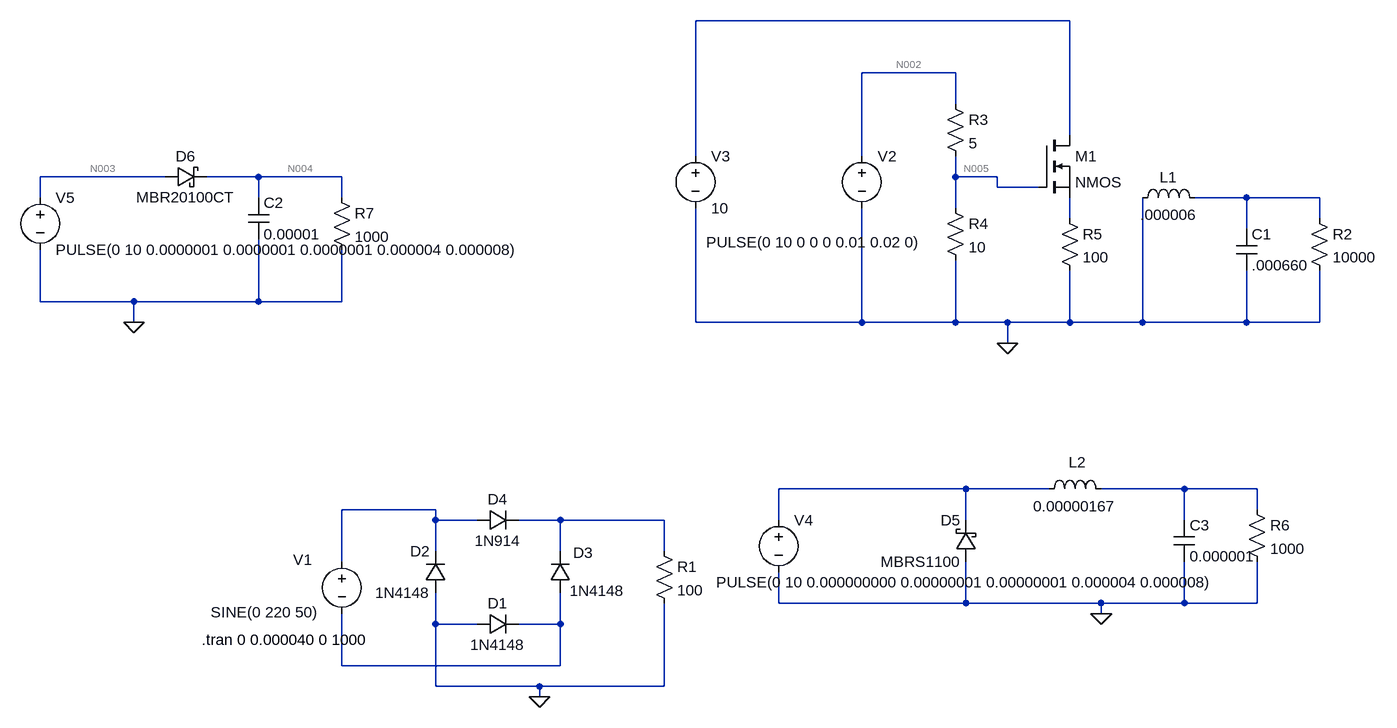
[diagram p0: schematic circuit_ver1.6.asc]
circuit_ver1.6.asc, the LTspice schematic file:
Version 4
SHEET 1 880 680
WIRE -128 -720 -704 -720
WIRE -304 -640 -448 -640
WIRE -304 -592 -304 -640
WIRE -128 -544 -128 -720
WIRE -704 -512 -704 -720
WIRE -448 -512 -448 -640
WIRE -1520 -480 -1712 -480
WIRE -1376 -480 -1456 -480
WIRE -1248 -480 -1376 -480
WIRE -304 -480 -304 -512
WIRE -240 -480 -304 -480
WIRE -240 -464 -240 -480
WIRE -176 -464 -240 -464
WIRE -1712 -448 -1712 -480
WIRE -1376 -448 -1376 -480
WIRE -1248 -448 -1248 -480
WIRE 144 -448 64 -448
WIRE 256 -448 144 -448
WIRE -304 -432 -304 -480
WIRE -128 -416 -128 -448
WIRE 256 -416 256 -448
WIRE 144 -400 144 -448
WIRE -1712 -288 -1712 -368
WIRE -1568 -288 -1712 -288
WIRE -1376 -288 -1376 -384
WIRE -1376 -288 -1568 -288
WIRE -1248 -288 -1248 -368
WIRE -1248 -288 -1376 -288
WIRE -1568 -256 -1568 -288
WIRE -704 -256 -704 -432
WIRE -448 -256 -448 -432
WIRE -448 -256 -704 -256
WIRE -304 -256 -304 -352
WIRE -304 -256 -448 -256
WIRE -224 -256 -304 -256
WIRE -128 -256 -128 -336
WIRE -128 -256 -224 -256
WIRE -16 -256 -16 -448
WIRE -16 -256 -128 -256
WIRE 144 -256 144 -336
WIRE 144 -256 -16 -256
WIRE 256 -256 256 -336
WIRE 256 -256 144 -256
WIRE -224 -224 -224 -256
WIRE -288 0 -576 0
WIRE -160 0 -288 0
WIRE 48 0 -80 0
WIRE 160 0 48 0
WIRE -1104 32 -1248 32
WIRE 160 32 160 0
WIRE -1104 48 -1104 32
WIRE -1040 48 -1104 48
WIRE -912 48 -976 48
WIRE -752 48 -912 48
WIRE -576 48 -576 0
WIRE -288 48 -288 0
WIRE 48 48 48 0
WIRE -1104 96 -1104 48
WIRE -912 96 -912 48
WIRE -752 96 -752 48
WIRE -1248 112 -1248 32
WIRE -576 176 -576 128
WIRE -288 176 -288 112
WIRE -288 176 -576 176
WIRE -80 176 -288 176
WIRE 48 176 48 112
WIRE 48 176 -80 176
WIRE 160 176 160 112
WIRE 160 176 48 176
WIRE -80 192 -80 176
WIRE -1104 208 -1104 160
WIRE -1040 208 -1104 208
WIRE -912 208 -912 160
WIRE -912 208 -976 208
WIRE -1248 272 -1248 192
WIRE -912 272 -912 208
WIRE -912 272 -1248 272
WIRE -1104 304 -1104 208
WIRE -944 304 -1104 304
WIRE -752 304 -752 176
WIRE -752 304 -944 304
WIRE -944 320 -944 304
FLAG -944 320 0
FLAG -224 -224 0
FLAG -80 192 0
FLAG -1568 -256 0
SYMBOL voltage -1248 96 R0
WINDOW 3 -202 94 Left 2
WINDOW 123 0 0 Left 2
WINDOW 39 0 0 Left 2
WINDOW 0 -75 13 Left 2
SYMATTR Value SINE(0 220 50)
SYMATTR InstName V1
SYMBOL diode -1040 224 R270
WINDOW 0 32 32 VTop 2
WINDOW 3 0 32 VBottom 2
SYMATTR InstName D1
SYMATTR Value 1N4148
SYMBOL diode -1088 160 R180
WINDOW 0 24 64 Left 2
WINDOW 3 24 0 Left 2
SYMATTR InstName D2
SYMATTR Value 1N4148
SYMBOL diode -896 160 R180
WINDOW 0 -35 62 Left 2
WINDOW 3 -83 3 Left 2
SYMATTR InstName D3
SYMATTR Value 1N4148
SYMBOL diode -1040 64 R270
WINDOW 0 32 32 VTop 2
WINDOW 3 0 32 VBottom 2
SYMATTR InstName D4
SYMATTR Value 1N914
SYMBOL res -768 80 R0
SYMATTR InstName R1
SYMATTR Value 100
SYMBOL voltage -448 -528 R0
WINDOW 3 91 149 Right 2
WINDOW 123 0 0 Left 2
WINDOW 39 0 0 Left 2
SYMATTR Value PULSE(0 10 0 0 0 0.01 0.02 0)
SYMATTR InstName V2
SYMBOL nmos -176 -544 R0
SYMATTR InstName M1
SYMBOL res 240 -432 R0
SYMATTR InstName R2
SYMATTR Value 10000
SYMBOL res -320 -608 R0
SYMATTR InstName R3
SYMATTR Value 5
SYMBOL res -320 -448 R0
SYMATTR InstName R4
SYMATTR Value 10
SYMBOL voltage -704 -528 R0
WINDOW 123 0 0 Left 2
WINDOW 39 0 0 Left 2
SYMATTR InstName V3
SYMATTR Value 10
SYMBOL ind -32 -432 R270
WINDOW 0 32 56 VTop 2
WINDOW 3 5 56 VBottom 2
SYMATTR InstName L1
SYMATTR Value .000006
SYMBOL cap 128 -400 R0
SYMATTR InstName C1
SYMATTR Value .000660
SYMATTR SpiceLine V=50
SYMBOL res -144 -432 R0
SYMATTR InstName R5
SYMATTR Value 100
SYMBOL ind -176 16 R270
WINDOW 0 41 60 VTop 2
WINDOW 3 5 56 VBottom 2
SYMATTR InstName L2
SYMATTR Value 0.00000167
SYMBOL res 144 16 R0
SYMATTR InstName R6
SYMATTR Value 1000
SYMBOL voltage -576 32 R0
WINDOW 3 -96 112 Left 2
WINDOW 123 0 0 Left 2
WINDOW 39 0 0 Left 2
SYMATTR Value PULSE(0 10 0.000000000 0.00000001 0.00000001 0.000004 0.000008)
SYMATTR InstName V4
SYMBOL schottky -272 112 R180
WINDOW 0 24 64 Left 2
WINDOW 3 24 0 Left 2
SYMATTR InstName D5
SYMATTR Value MBRS1100
SYMATTR Description Diode
SYMATTR Type diode
SYMBOL schottky -1520 -464 R270
WINDOW 0 32 32 VTop 2
WINDOW 3 0 32 VBottom 2
SYMATTR InstName D6
SYMATTR Value MBR20100CT
SYMATTR Description Diode
SYMATTR Type diode
SYMBOL cap -1392 -448 R0
SYMATTR InstName C2
SYMATTR Value 0.00001
SYMBOL voltage -1712 -464 R0
WINDOW 123 0 0 Left 2
WINDOW 39 0 0 Left 2
SYMATTR InstName V5
SYMATTR Value PULSE(0 10 0.0000001 0.0000001 0.0000001 0.000004 0.000008)
SYMBOL res -1264 -464 R0
SYMATTR InstName R7
SYMATTR Value 1000
SYMBOL cap 32 48 R0
SYMATTR InstName C3
SYMATTR Value 0.000001
TEXT -1464 232 Left 2 !.tran 0 0.000040 0 1000

The netlist it stands for:
* circuit_ver1.6.asc
V1 N010 N012 SINE(0 220 50)
D1 0 N012 1N4148
D2 0 N010 1N4148
D3 N012 N011 1N4148
D4 N010 N011 1N914
R1 N011 0 100
V2 N002 0 PULSE(0 10 0 0 0 0.01 0.02 0)
M1 N001 N005 N007 N007 NMOS
R2 N006 0 10000
R3 N002 N005 5
R4 N005 0 10
V3 N001 0 10
L1 0 N006 .000006
C1 N006 0 .000660 V=50
R5 N007 0 100
L2 N008 N009 0.00000167
R6 N009 0 1000
V4 N008 0 PULSE(0 10 0.000000000 0.00000001 0.00000001 0.000004 0.000008)
D5 0 N008 MBRS1100
D6 N003 N004 MBR20100CT
C2 N004 0 0.00001
V5 N003 0 PULSE(0 10 0.0000001 0.0000001 0.0000001 0.000004 0.000008)
R7 N004 0 1000
C3 N009 0 0.000001
.model D D
.lib standard.dio
.model NMOS NMOS
.model PMOS PMOS
.lib standard.mos
.tran 0 0.000040 0 1000
.backanno
.end

* Results of the author's LTspice run, read from the files saved beside the schematic
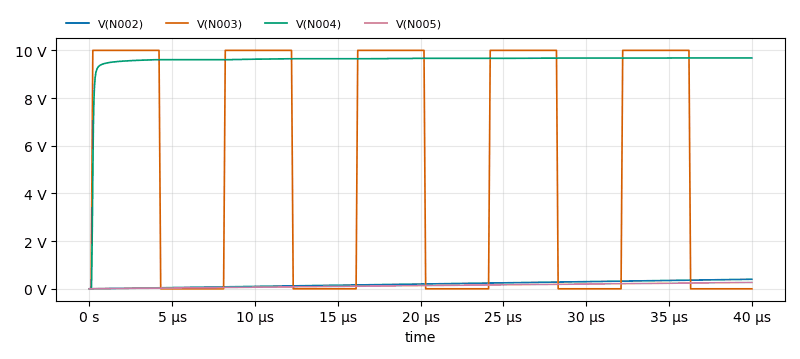
[diagram p1: Transient Analysis of circuit_ver1.6.asc, plotted from the saved traces]
* Transient Analysis, 1 run:
*   V(N002): min 0 V, max 400 mV, average 200 mV, rms 230.9 mV, last 400 mV
*   V(N003): min 0 V, max 10 V, average 5.125 V, rms 7.131 V, last 0 V
*   V(N004): min 0 V, max 9.684 V, average 9.593 V, rms 9.614 V, last 9.68 V
*   V(N005): min 0 V, max 266.7 mV, average 133.3 mV, rms 154 mV, last 266.7 mV